# Altium schematic sheet PowerSupply.SchDoc
size A4
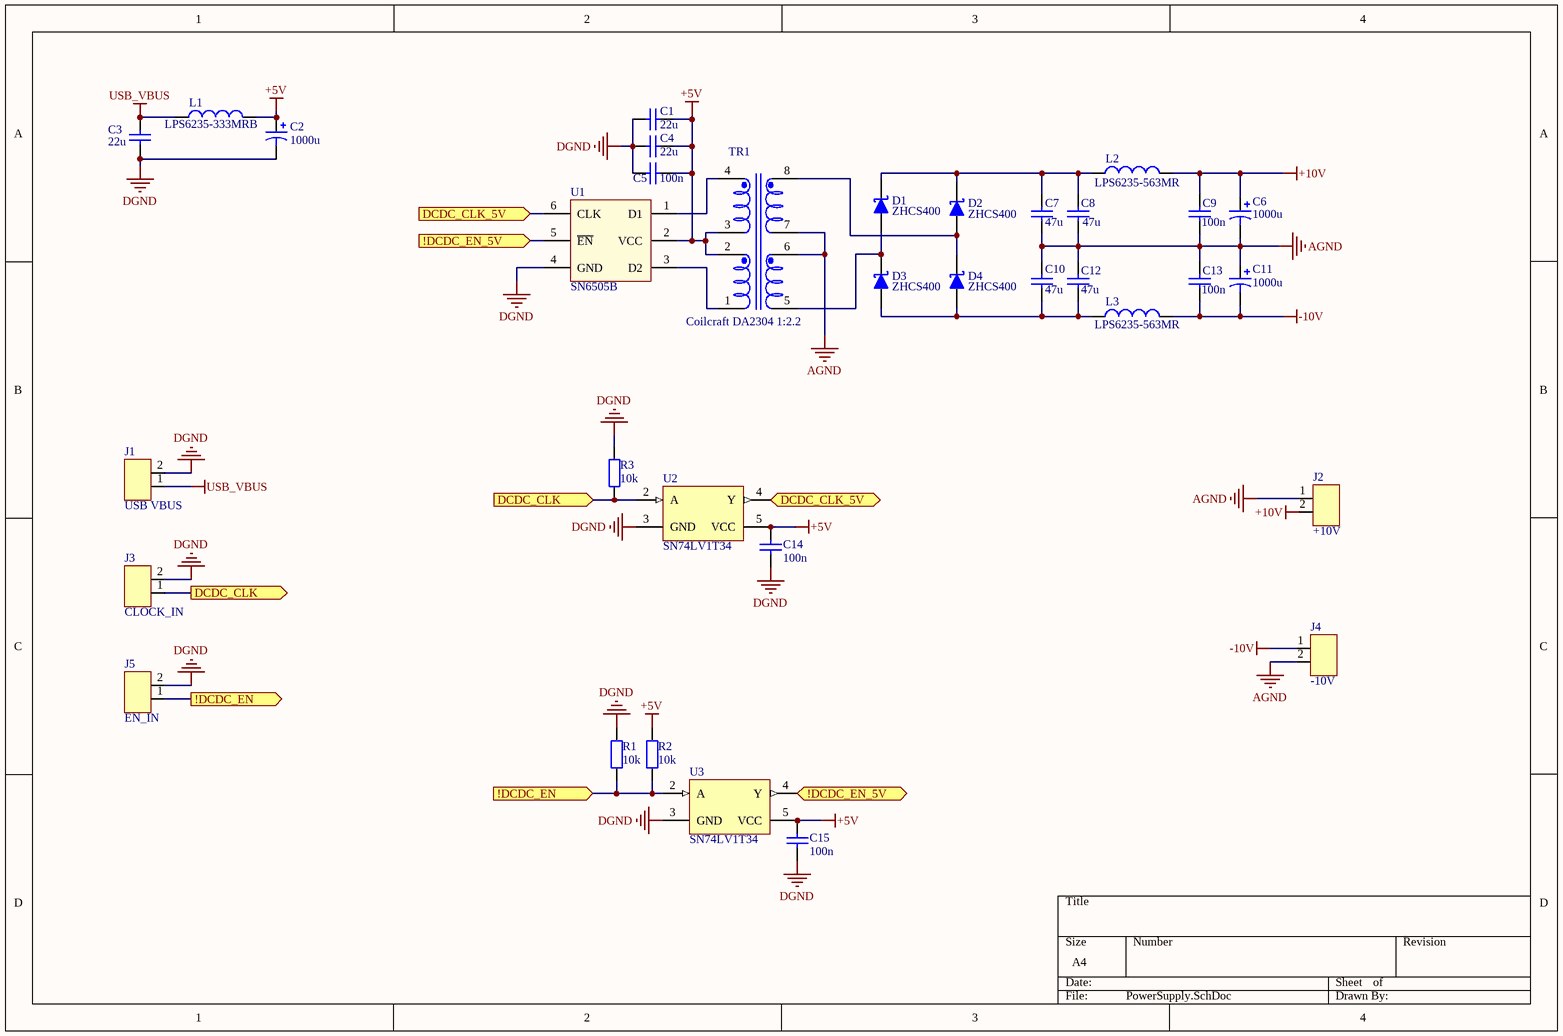
[diagram p0: PowerSupply.SchDoc]

## Parts
C1  22u  [PCB-6alau6k4isvsg1wxu4va-1]
C2  1000u  [A750MS827M1CAAE013]
C3  22u  [PCB-6alau6k4isvsg1wxu4va-1]
C4  22u  [PCB-6alau6k4isvsg1wxu4va-1]
C5  100n  [PCB-rf0pzaa82dpbeu9l4sxm-1]
C6  1000u  [A750MS827M1CAAE013]
C7  47u  [PCB-6alau6k4isvsg1wxu4va-1]
C8  47u  [PCB-6alau6k4isvsg1wxu4va-1]
C9  100n  [PCB-rf0pzaa82dpbeu9l4sxm-1]
C10  47u  [PCB-6alau6k4isvsg1wxu4va-1]
C11  1000u  [A750MS827M1CAAE013]
C12  47u  [PCB-6alau6k4isvsg1wxu4va-1]
C13  100n  [PCB-rf0pzaa82dpbeu9l4sxm-1]
C14  100n  [PCB-rf0pzaa82dpbeu9l4sxm-1]
C15  100n  [PCB-rf0pzaa82dpbeu9l4sxm-1]
D1  ZHCS400  [PCB-mrclmtn06znaca5ywvvw-1]
D2  ZHCS400  [PCB-mrclmtn06znaca5ywvvw-1]
D3  ZHCS400  [PCB-mrclmtn06znaca5ywvvw-1]
D4  ZHCS400  [PCB-mrclmtn06znaca5ywvvw-1]
J1  USB VBUS  [PCB-zvoqahoa32c7hpr4zz1z-1]
J2  +10V  [PCB-zvoqahoa32c7hpr4zz1z-1]
J3  CLOCK_IN  [PCB-zvoqahoa32c7hpr4zz1z-1]
J4  -10V  [PCB-zvoqahoa32c7hpr4zz1z-1]
J5  EN_IN  [PCB-zvoqahoa32c7hpr4zz1z-1]
L1  LPS6235-333MRB  [LPS6235]
L2  LPS6235-563MR  [PCB-91apuy3syfgd6vk6qbo6-1]
L3  LPS6235-563MR  [PCB-91apuy3syfgd6vk6qbo6-1]
R1  10k  [PCB-3d5y3t7f8drf35yjcj59-1]
R2  10k  [PCB-3d5y3t7f8drf35yjcj59-1]
R3  10k  [PCB-3d5y3t7f8drf35yjcj59-1]
TR1  Coilcraft DA2304 1:2.2  [PCB-wryx25zm61bkpund2vng-1]
U1  SN6505B  [PCB-z49b8x4xdp07datjgpqp-1]
U2  SN74LV1T34  [PCB-0ardthfs7lzl2yengne1-1]
U3  SN74LV1T34  [PCB-0ardthfs7lzl2yengne1-1]

## Ports
!DCDC_EN (in), !DCDC_EN (out), !DCDC_EN_5V (in), !DCDC_EN_5V (out), DCDC_CLK (in), DCDC_CLK (out), DCDC_CLK_5V (in), DCDC_CLK_5V (out)

## Nets
+5V: C1.1 C2.1 C4.1 C5.1 C14.2 C15.2 L1.2 R2.2 TR1.2 TR1.3 U1.2(VCC) U2.5(VCC) U3.5(VCC)
+10V: C6.1 C9.2 J2.2 L2.2
-10V: C11.2 C13.1 J4.1 L3.2
AGND: C6.2 C7.1 C8.1 C9.1 C10.2 C11.1 C12.2 C13.2 J2.1 J4.2 TR1.6 TR1.7
DGND: C1.2 C2.2 C3.1 C4.2 C5.2 C14.1 C15.1 J1.2 J3.2 J5.2 R1.2 R3.2 U1.4(GND) U2.3(GND) U3.3(GND)
USB_VBUS: C3.2 J1.1 L1.1
!DCDC_EN: J5.1 R1.1 R2.1 U3.2(A) ; port !DCDC_EN
!DCDC_EN_5V: U1.5(~{EN}) U3.4(Y) ; port !DCDC_EN_5V
DCDC_CLK: J3.1 R3.1 U2.2(A) ; port DCDC_CLK
DCDC_CLK_5V: U1.6(CLK) U2.4(Y) ; port DCDC_CLK_5V
NetC7_2: C7.2 C8.2 D1.2(K) D2.2(K) L2.1
NetC10_1: C10.1 C12.1 D3.1(A) D4.1(A) L3.1
NetD1_1: D1.1(A) D3.2(K) TR1.5
NetD2_1: D2.1(A) D4.2(K) TR1.8
NetTR1_1: TR1.1 U1.3(D2)
NetTR1_4: TR1.4 U1.1(D1)

## Library data of the parts
C1 C3 C4 C7 C8 C10 C12 = CMP-a2006a3718e57dc7-1: 1210 100 uF 16 V ±20% Tolerance X5R SMT Multilayer Ceramic Capacitor; Case/Package: 1210
C2 C6 C11 = CMP-1544d833d83eca83-6: Cap Aluminum Polymer 1000uF 16VDC 20% (10 X 12mm) Radial 5mm 0.013 Ohm 5250mA 2000h 105C Bag; Equivalent Series Resistance (ESR): 13.0 mΩ; Voltage Rating (DC): 16.0 V; Mounting Style: Through Hole; Size-Height: 12.0 mm; OctopartID: 1544d833d83eca83
C5 C9 C13-C15 = CMP-x8hddryxw4o380xfi98v-1: Capacitor 0603; CustomComponentID: x8hddryxw4o380xfi98v
D1-D4 = CMP-3796931-5: Schottky Rectifier, 0.4A, 40V SOD-323; Power Rating: 250 mW; REACH SVHC Compliance: No SVHC; Packaging: Cut Tape (CT); Octopart URL: https://octopart.com/zhcs400-diodes+inc.-13152663; Case/Package: SOD-323; Lifecycle Status: Active; RoHS: Compliant; OctopartID: 21c3e801b532fe04; Manufacturer Part Number: ZHCS400
J1-J5 = CMP-b40c7d06b3056bcb-5: Conn; Rect; InterConnSys; Header; 2Cont; Thru-Hole; KKSeries; 0.10InPin-Spng; Straight; Insulation Resistance: 50000000000.0 Ω; Pin Pitch: 0.00254 m; Number of Contacts: 2; Gender: Male; Voltage Rating (DC): 250.0 V; Lead-Free Status: Lead Free; Current Rating: 4.0 A; Flammability Rating: UL 94 V-0; Number of Rows: 1; Housing Material: Nylon; OctopartID: b40c7d06b3056bcb; Size-Length: 0.00508 m; Size-Width: 0.00635 m; Contact Plating: Gold; Housing Color: White; Lifecycle Status: Not Listed by Manufacturer; Mounting Style: Through Hole; Number of Positions: 2; Packaging: Bulk; RoHS: Compliant; Color: White; Octopart URL: http://octopart.com/22-11-2022-molex-8815; Size-Height: 0.00818 m; Manufacturer Part Number: 22-11-2022; Contact Material: Brass
L1 = CMP-f5873d4763982a40-2: Power inductor, shielded, 20% tol, SMT, RoHS, lead-free, halogen-free
L2 L3 = CMP-db2813e84dcb04ef-1: Power inductor, shielded, 20% tol, SMT, RoHS, lead-free, halogen-free; Inductance: 56.0 µH; REACH SVHC Compliance: No SVHC; Packaging: Cut Tape (CT); Lifecycle Status: Active
R1-R3 = CMP-xcu3s4ikiffkkgbeyow5-1: Resistor 0603; CustomComponentID: xcu3s4ikiffkkgbeyow5
TR1 = CMP-7cc7b5ab862da300-5: Transformer, for ADM2485, 5-6V, SMT, RoHS; Manufacturer Part Number: DA2303-ALB; Lead-Free Status: Contains Lead; Lifecycle Status: Active; Mounting Style: Surface Mount; OctopartID: 7cc7b5ab862da300; RoHS: Compliant; Octopart URL: https://octopart.com/da2303-alb-coilcraft-6741900
U1 = CMP-a28c686de0427d4b-3: Low-Noise 1 A, 420 kHz Transformer Driver 6-SOT-23 -55 to 125; Manufacturer Part Number: SN6505BDBVT; Lead-Free Status: Lead Free; RoHS: Compliant; Packaging: Cut Tape (CT); Number of Pins: 6; Lifecycle Status: Active; Case/Package: SOT-23; Octopart URL: http://octopart.com/sn6505bdbvr-texas+instruments-65759143; OctopartID: 65ebaf0a272aba2c
U2 U3 = CMP-3a3bf2ca9c96e5fc-1: Single Power Supply BUFFER Logic Level Shifter (no enable) 5-SC70 -40 to 125; Manufacturer Part Number: SN74LV1T34DCKR; Lead-Free Status: Lead Free; Octopart URL: http://octopart.com/sn74lv1t34dckr-texas+instruments-33260491; Lifecycle Status: Active; RoHS: Compliant; OctopartID: 3a3bf2ca9c96e5fc